# Altium schematic sheet NILINET_POWER_PIR.SchDoc
size A3
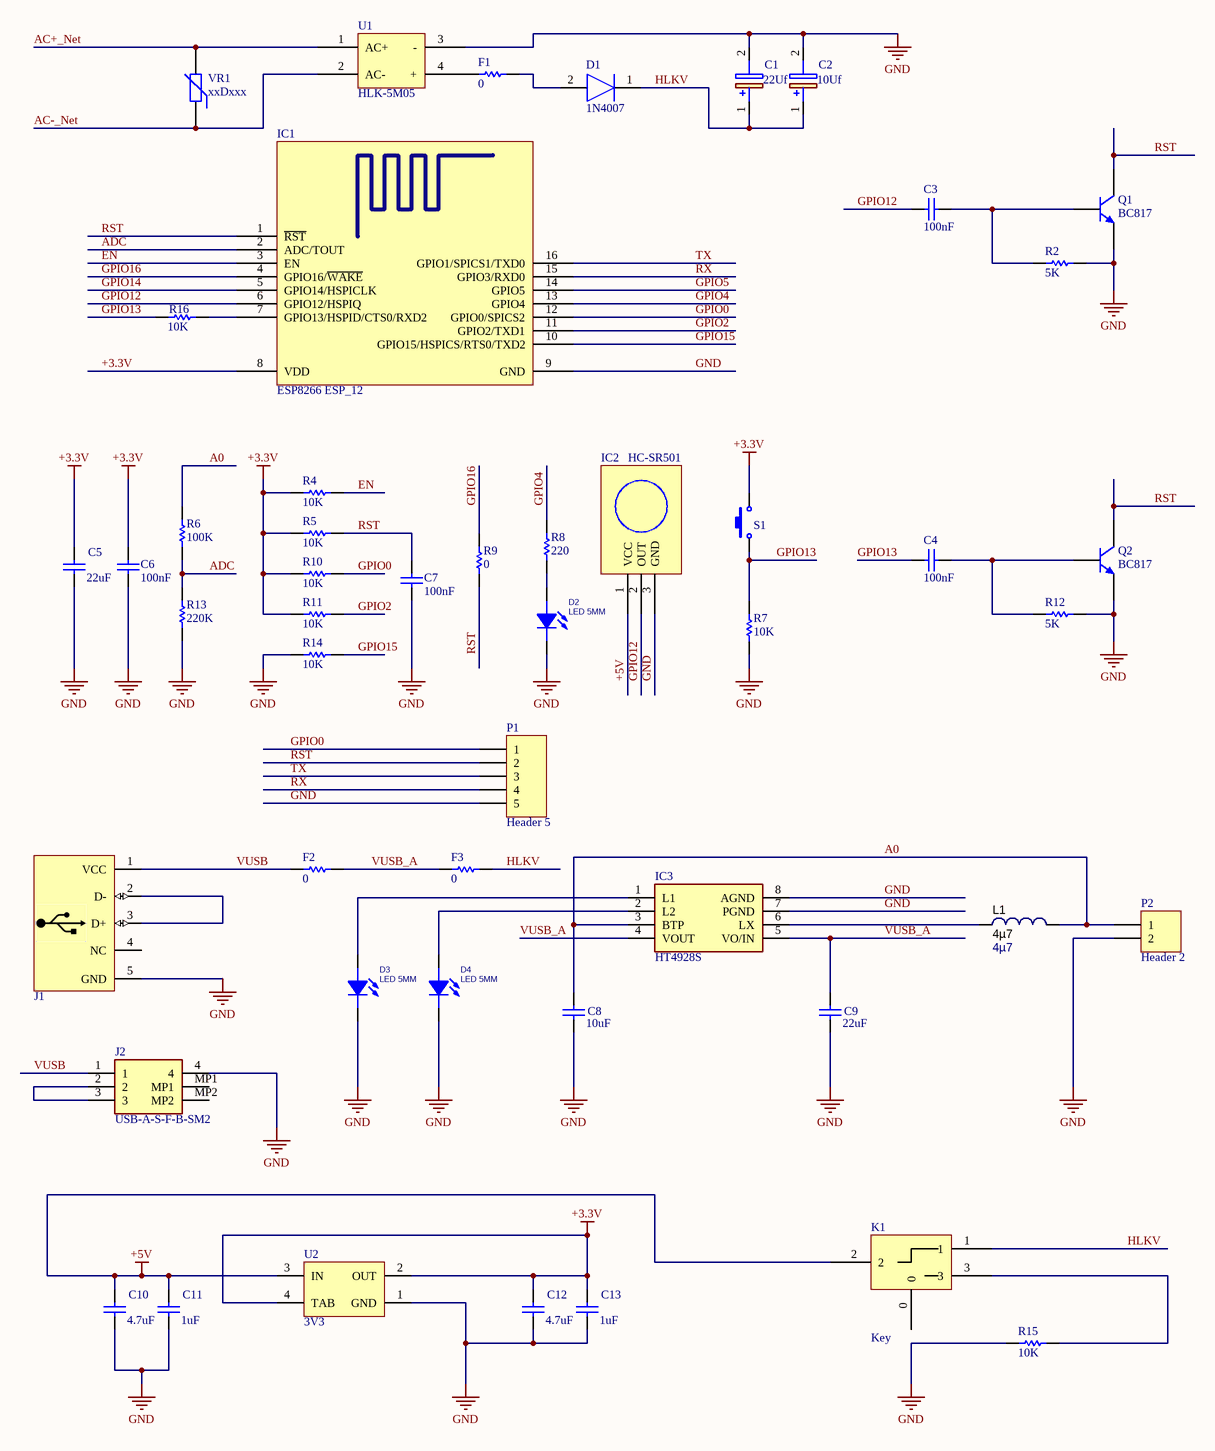
[diagram p0: NILINET_POWER_PIR.SchDoc]

## Parts
C1  22Uf  [UWT(4X5.4)]
C2  10Uf  [UWT(4X5.4)]
C3  100nF  [CAP0603]
C4  100nF  [CAP0603]
C5  22uF  [CAP0805]
C6  100nF  [CAP0603]
C7  100nF  [CAP0603]
C8  10uF  [CAP0805]
C9  22uF  [CAP0805]
C10  4.7uF  [CAP0805]
C11  1uF  [CAP0805]
C12  4.7uF  [CAP0805]
C13  1uF  [CAP0805]
D1  1N4007  [DIOM5327X242N]
D2  LED 5MM  [LED5MM_BLUE]
D3  LED 5MM  [LED5MM_RED]
D4  LED 5MM  [LED5MM_GRN]
F1  0  [RES0805]
F2  0  [RES0805]
F3  0  [RES0805]
IC1  ESP8266 ESP_12  [ESP8266 ESP_12]
IC2  HC-SR501  [jumper selector]
IC3  HT4928S  [SOIC127P600X180-8N]
J1  USB Connector  [MicroUSB111]  (value not drawn)
J2  USB-A-S-F-B-SM2  [USBASFBSM3]
K1  Key  [Key]
L1  4µ7  [Inductor SMD 3x3.2mm]
P1  Header 5  [HDR1X5]
P2  Header 2  [HDR1X2]
Q1  BC817  [SOT23_N]
Q2  BC817  [SOT23_N]
R2  5K  [RES0603]
R4  10K  [RES0603]
R5  10K  [RES0603]
R6  100K  [RES0603]
R7  10K  [RES0603]
R8  220  [RES0603]
R9  0  [RES0603]
R10  10K  [RES0603]
R11  10K  [RES0603]
R12  5K  [RES0603]
R13  220K  [RES0603]
R14  10K  [RES0603]
R15  10K  [RES0603]
R16  10K  [RES0603]
S1  Switch PB  [SwitchRight]  (value not drawn)
U1  HLK-5M05  [HLK-5M05]
U2  3V3  [SOT223]
VR1  xxDxxx  [10D XXX]

## Nets
+3.3V: C5.2 C6.2 C12.2 C13.2 IC1.8(VDD) R4.2 R5.2 R10.2 R11.2 S1.2 U2.2(OUT) U2.4(TAB)
+5V: C10.2 C11.2 IC2.1(VCC) K1.2 U2.3(IN)
GND: C1.2(-) C2.2(-) C5.1 C6.1 C7.1 C8.1 C9.1 C10.1 C11.1 C12.1 C13.1 D2.2(CATHODE) D3.2(CATHODE) D4.2(CATHODE) IC1.9(GND) IC2.3(GND) IC3.7(PGND) IC3.8(AGND) J1.5(GND) J2.4 P1.5 P2.2 Q1.2(E) Q2.2(E) R2.1 R7.2 R12.1 R13.1 R14.2 R15.2 U1.3(-) U2.1(GND)
A0: C8.2 IC3.3(BTP) L1.2 P2.1 R6.2
AC+_Net: U1.1(AC+) VR1.2
AC-_Net: U1.2(AC-) VR1.1
ADC: IC1.2(ADC/TOUT) R6.1 R13.2
EN: IC1.3(EN) R4.1
GPIO0: IC1.12(GPIO0/SPICS2) P1.1 R10.1
GPIO2: IC1.11(GPIO2/TXD1) R11.1
GPIO4: IC1.13(GPIO4) R8.1
GPIO5: IC1.14(GPIO5)
GPIO12: C3.2 IC1.6(GPIO12/HSPIQ) IC2.2(OUT)
GPIO13: C4.2 R7.1 R16.2 S1.1
GPIO14: IC1.5(GPIO14/HSPICLK)
GPIO15: IC1.10(GPIO15/HSPICS/RTS0/TXD2) R14.1
GPIO16: IC1.4(GPIO16/~{WAKE}) R9.1
HLKV: C1.1(+) C2.1(+) D1.1(K) F3.1 K1.1
RST: C7.2 IC1.1(~{RST}) P1.2 Q1.3(C) Q2.3(C) R5.1 R9.2
RX: IC1.15(GPIO3/RXD0) P1.4
TX: IC1.16(GPIO1/SPICS1/TXD0) P1.3
VUSB: F2.2 J1.1(VCC) J2.1
VUSB_A: C9.2 F2.1 F3.2 IC3.4(VOUT) IC3.5(VO/IN)
NetC3_1: C3.1 Q1.1(B) R2.2
NetC4_1: C4.1 Q2.1(B) R12.2
NetD1_2: D1.2(A) F1.1
NetD2_1: D2.1(ANODE) R8.2
NetD3_1: D3.1(ANODE) IC3.1(L1)
NetD4_1: D4.1(ANODE) IC3.2(L2)
NetF1_2: F1.2 U1.4(+)
NetIC1_7: IC1.7(GPIO13/HSPID/CTS0/RXD2) R16.1
NetIC3_6: IC3.6(LX) L1.1
NetJ1_2: J1.2(D-) J1.3(D+)
NetJ2_2: J2.2 J2.3
NetK1_3: K1.3 R15.1

Not connected (* = marked no-connect by the designer): J1 4(NC); J2 MP1 MP2; K1 0

## Library data of the parts
C1 C2 = UWT1C100MCL1GB: Capacitor Polarised; Manufacturer_Name: Nichicon; Allied_Number: 70409828; Datasheet Link: http://www.nichicon.co.jp/english/products/pdfs/e-uwt.pdf; Manufacturer_Part_Number: UWT1C100MCL1GB; Mouser Part Number: 647-UWT1C100MCL1B; Mouser Price/Stock: https://www.mouser.co.uk/ProductDetail/Nichicon/UWT1C100MCL1GB?qs=VVKQmw408U%252BpNF7TgczwPw%3D%3D; RS Part Number: 5201854P; RS Price/Stock: http://uk.rs-online.com/web/p/products/5201854P; Allied Price/Stock: https://www.alliedelec.com/nichicon-uwt1c100mcl1gb/70409828/
C3 C4 C6 C7 = CAP SMD PACKAGE: TOTAL CAPACITOR SMD PACK; Designer: Abbas Basereh; Desc.: CAP SMD TOTAL PACKAGES; Data: 2017-3-10; VALUE: 100nF
C5 C8-C13 = CAP SMD PACKAGE: TOTAL CAPACITOR SMD PACK; Designer: Abbas Basereh; Desc.: CAP SMD TOTAL PACKAGES; VALUE: 100nF; Data: 2017-3-10
D1 = 1N4007: Diode; Manufacturer_Name: Shikues; Datasheet Link: https://datasheet.lcsc.com/szlcsc/SK-1N4007_C126233.pdf; Height: 2.42mm; Manufacturer_Part_Number: 1N4007
D2-D4 = LED 5MM: Light Emitting Diode; Designer: Abbas Basereh; Data: 16-12-2016; Link: *; Part.No: *
F1-F3 R2 R4-R16 = RES SMD PACKAGE: TOTAL SMD RESISTOR PACK; Designer: Abbas Basereh; Desc.: RES SMD PAKAGES; Data: 2017-3-10
IC1 = ESP8266 ESP_12: ESP8266 ESP-12; IC: ESP8266-EX; Vendor: Ai-thinker; LatestReviewer: Zion Blue; Published: 14-Apr-2015; Publisher: Cynetik Group; LatestRevisionData: 14-Apr-2015; LatestRevisionNote: Include 3D body and Footprint
IC3 = HT4928S: Integrated Circuit; Manufacturer_Name: HOTCHIP; Datasheet Link: http://www.hotchip.com.cn/Uploads/goods/2017-11-03/59fc3d69cabf0.pdf; Height: 1.8mm; Manufacturer_Part_Number: HT4928S
J1 = USB MICRO: USB Connector MICRO-B Type; Designer: ABBAS BASEREH; Max Current: 1600mA; Mounting Technology: Surface Mount\Through-Hole; Category: Connector; Pin Count: 5-7; Publisher: ABBAS BASEREH; Status: Unreleased; ComponentLink1Description: Datasheet; ComponentLink2Description: Reference; Update: 1395-11-17
J2 = USB-A-S-F-B-SM2: Connector; Manufacturer_Name: SAMTEC; Datasheet Link: https://www.arrow.com/en/products/usb-a-s-f-b-sm2/samtec; Height: 7.03mm; Manufacturer_Part_Number: USB-A-S-F-B-SM2; Mouser Part Number: 200-USBASFBSM2; Mouser Price/Stock: https://www.mouser.com/Search/Refine.aspx?Keyword=200-USBASFBSM2; RS Part Number: 1803451; RS Price/Stock: http://uk.rs-online.com/web/p/products/1803451
L1 = Inductor 4.7µH SMD 3x3.2mm: Tolerance: ±20%; Type: Ferrite Core; SCDType: source; Package / Case: Inductor 4.7µH SMD 3x3.2mm; Supplier 1: Digi-Key; Operating Temperature: -40°C ~ 125°C; Value: 4µ7
P1 = Header 5: Header, 5-Pin; LatestRevisionDate: 17-Jul-2002; LatestRevisionNote: Re-released for DXP Platform.; Publisher: Altium Limited
P2 = Header 2: Header, 2-Pin; LatestRevisionDate: 17-Jul-2002; LatestRevisionNote: Re-released for DXP Platform.; Publisher: Altium Limited
Q1 Q2 = BC817: 45 V, 500 mA NPN general-purpose transistors; Published: 2017-2-8; LatestRevisionDate: 2017; LatestRevisionNote: IPC-7351 Footprint Added.; DatasheetVersion: 2017; PackageVersion: 2017-2-8; PackageReference: SOT23; Publisher: Abbas Basereh; PackageDescription: 3-Pin SOT-23 Package 0.95 mm Pitch, 2.3 mm Lead Span; ComponentLink1Description: Manufacturer Link; ComponentLink1URL: http://www.nxp.com/; ComponentLink2Description: Datasheet; ComponentLink2URL: http://www.nxp.com/
S1 = Switch PB: Push Button Switch
U1 = HLK-PM01
U2 = AMS1117-x.x: x.x Volt, 800mA Low-Dropout Linear Regulator, 4-pin SOT-223; Designer: Ali Hafizi; Data: 16-12-2016
VR1 = VARISTOR (VDR): VARISTORS; Manufacturer: china-canada-philipina; Designer: Abbas Basereh; Models: MOV-VDR-COV; Data: 2017-1-5; Link: digikey.com; VALUE: xxDxxx; PUBLISHER: ABBAS BASEREH